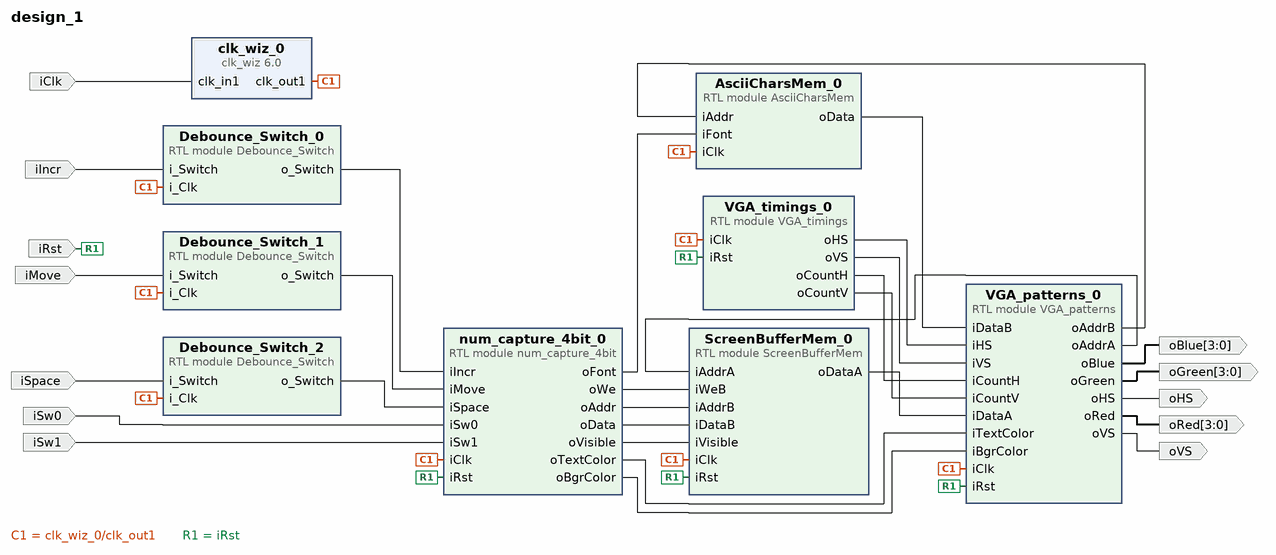
[diagram p0: block diagram of the top level]
# Vivado block design design_1, xc7z020clg400-1, Vivado 2020.1
create_bd_design design_1

create_bd_port -dir O oHS
create_bd_port -dir O oVS
create_bd_port -dir O -from 3 -to 0 oRed
create_bd_port -dir O -from 3 -to 0 oGreen
create_bd_port -dir O -from 3 -to 0 oBlue
create_bd_port -dir I -type clk iClk
create_bd_port -dir I iRst
create_bd_port -dir I iIncr
create_bd_port -dir I iMove
create_bd_port -dir I iSpace
create_bd_port -dir I iSw0
create_bd_port -dir I iSw1

create_bd_cell -type ip -vlnv xilinx.com:ip:clk_wiz:6.0 clk_wiz_0
set_property -dict [list \
  CONFIG.CLKIN1_JITTER_PS 80.0 \
  CONFIG.CLKOUT1_JITTER 312.659 \
  CONFIG.CLKOUT1_PHASE_ERROR 245.713 \
  CONFIG.CLKOUT1_REQUESTED_OUT_FREQ 25 \
  CONFIG.CLK_IN1_BOARD_INTERFACE sys_clock \
  CONFIG.MMCM_CLKFBOUT_MULT_F 36.500 \
  CONFIG.MMCM_CLKIN1_PERIOD 8.000 \
  CONFIG.MMCM_CLKOUT0_DIVIDE_F 36.500 \
  CONFIG.MMCM_DIVCLK_DIVIDE 5 \
  CONFIG.USE_LOCKED false \
  CONFIG.USE_RESET false \
] [get_bd_cells clk_wiz_0]
create_bd_cell -type module -reference VGA_timings VGA_timings_0
create_bd_cell -type module -reference Debounce_Switch Debounce_Switch_0
create_bd_cell -type module -reference Debounce_Switch Debounce_Switch_1
create_bd_cell -type module -reference Debounce_Switch Debounce_Switch_2
create_bd_cell -type module -reference VGA_patterns VGA_patterns_0
create_bd_cell -type module -reference AsciiCharsMem AsciiCharsMem_0
create_bd_cell -type module -reference num_capture_4bit num_capture_4bit_0
create_bd_cell -type module -reference ScreenBufferMem ScreenBufferMem_0

# ---- connections ----

connect_bd_net [get_bd_pins VGA_timings_0/oHS] [get_bd_pins VGA_patterns_0/iHS]
connect_bd_net [get_bd_pins VGA_timings_0/oVS] [get_bd_pins VGA_patterns_0/iVS]
connect_bd_net [get_bd_pins VGA_timings_0/oCountH] [get_bd_pins VGA_patterns_0/iCountH]
connect_bd_net [get_bd_pins VGA_timings_0/oCountV] [get_bd_pins VGA_patterns_0/iCountV]
connect_bd_net [get_bd_pins clk_wiz_0/clk_out1] \
  [get_bd_pins VGA_timings_0/iClk] [get_bd_pins Debounce_Switch_0/i_Clk] [get_bd_pins Debounce_Switch_1/i_Clk] \
  [get_bd_pins Debounce_Switch_2/i_Clk] [get_bd_pins VGA_patterns_0/iClk] [get_bd_pins AsciiCharsMem_0/iClk] \
  [get_bd_pins num_capture_4bit_0/iClk] [get_bd_pins ScreenBufferMem_0/iClk]
connect_bd_net [get_bd_pins ScreenBufferMem_0/oDataA] [get_bd_pins VGA_patterns_0/iDataA]
connect_bd_net [get_bd_pins VGA_patterns_0/oAddrA] [get_bd_pins ScreenBufferMem_0/iAddrA]
connect_bd_net [get_bd_pins VGA_patterns_0/oHS] [get_bd_ports oHS]
connect_bd_net [get_bd_pins VGA_patterns_0/oVS] [get_bd_ports oVS]
connect_bd_net [get_bd_pins VGA_patterns_0/oRed] [get_bd_ports oRed]
connect_bd_net [get_bd_pins VGA_patterns_0/oGreen] [get_bd_ports oGreen]
connect_bd_net [get_bd_pins VGA_patterns_0/oBlue] [get_bd_ports oBlue]
connect_bd_net -net iRst_0_1 [get_bd_ports iRst] \
  [get_bd_pins VGA_timings_0/iRst] [get_bd_pins VGA_patterns_0/iRst] [get_bd_pins num_capture_4bit_0/iRst] \
  [get_bd_pins ScreenBufferMem_0/iRst]
connect_bd_net [get_bd_pins VGA_patterns_0/oAddrB] [get_bd_pins AsciiCharsMem_0/iAddr]
connect_bd_net [get_bd_pins AsciiCharsMem_0/oData] [get_bd_pins VGA_patterns_0/iDataB]
connect_bd_net [get_bd_pins num_capture_4bit_0/oWe] [get_bd_pins ScreenBufferMem_0/iWeB]
connect_bd_net [get_bd_pins num_capture_4bit_0/oAddr] [get_bd_pins ScreenBufferMem_0/iAddrB]
connect_bd_net [get_bd_pins num_capture_4bit_0/oData] [get_bd_pins ScreenBufferMem_0/iDataB]
connect_bd_net [get_bd_pins Debounce_Switch_1/o_Switch] [get_bd_pins num_capture_4bit_0/iMove]
connect_bd_net [get_bd_pins Debounce_Switch_0/o_Switch] [get_bd_pins num_capture_4bit_0/iIncr]
connect_bd_net [get_bd_ports iClk] [get_bd_pins clk_wiz_0/clk_in1]
connect_bd_net -net i_Switch_0_1 [get_bd_ports iIncr] [get_bd_pins Debounce_Switch_0/i_Switch]
connect_bd_net -net i_Switch_0_2 [get_bd_ports iMove] [get_bd_pins Debounce_Switch_1/i_Switch]
connect_bd_net -net i_Switch_0_3 [get_bd_ports iSpace] [get_bd_pins Debounce_Switch_2/i_Switch]
connect_bd_net [get_bd_pins Debounce_Switch_2/o_Switch] [get_bd_pins num_capture_4bit_0/iSpace]
connect_bd_net -net iSw0_1 [get_bd_ports iSw0] [get_bd_pins num_capture_4bit_0/iSw0]
connect_bd_net -net iSw1_1 [get_bd_ports iSw1] [get_bd_pins num_capture_4bit_0/iSw1]
connect_bd_net [get_bd_pins num_capture_4bit_0/oTextColor] [get_bd_pins VGA_patterns_0/iTextColor]
connect_bd_net [get_bd_pins num_capture_4bit_0/oBgrColor] [get_bd_pins VGA_patterns_0/iBgrColor]
connect_bd_net [get_bd_pins num_capture_4bit_0/oFont] [get_bd_pins AsciiCharsMem_0/iFont]
connect_bd_net [get_bd_pins num_capture_4bit_0/oVisible] [get_bd_pins ScreenBufferMem_0/iVisible]

validate_bd_design
save_bd_design
